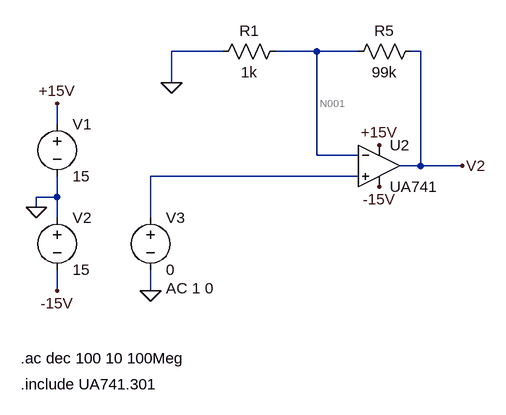
[diagram p0: schematic sim_ex2_g_10_non_invert.asc]
sim_ex2_g_10_non_invert.asc, the LTspice schematic file:
Version 4
SHEET 1 880 680
WIRE 0 -128 -80 -128
WIRE 144 -128 80 -128
WIRE 208 -128 144 -128
WIRE 304 -128 288 -128
WIRE -80 -80 -80 -128
WIRE -256 -16 -256 -48
WIRE 144 32 144 -128
WIRE 208 32 144 32
WIRE 304 48 304 -128
WIRE 304 48 272 48
WIRE 368 48 304 48
WIRE 208 64 -112 64
WIRE -256 96 -256 64
WIRE -256 96 -288 96
WIRE -288 112 -288 96
WIRE -256 128 -256 96
WIRE -112 128 -112 64
WIRE -256 240 -256 208
WIRE -112 240 -112 208
FLAG -288 112 0
FLAG -256 -48 +15V
FLAG -256 240 -15V
FLAG 240 16 +15V
FLAG 240 80 -15V
FLAG -112 240 0
FLAG 368 48 V2
FLAG -80 -80 0
SYMBOL voltage -256 -32 R0
WINDOW 123 0 0 Left 0
WINDOW 39 0 0 Left 0
SYMATTR InstName V1
SYMATTR Value 15
SYMBOL voltage -256 112 R0
WINDOW 123 0 0 Left 0
WINDOW 39 0 0 Left 0
SYMATTR InstName V2
SYMATTR Value 15
SYMBOL res 304 -144 R90
WINDOW 0 0 56 VBottom 2
WINDOW 3 32 56 VTop 2
SYMATTR InstName R5
SYMATTR Value 99k
SYMBOL voltage -112 112 R0
WINDOW 123 24 124 Left 2
WINDOW 39 0 0 Left 0
SYMATTR Value2 AC 1 0
SYMATTR InstName V3
SYMATTR Value 0
SYMBOL OpAmps\\opamp2 240 -16 R0
SYMATTR InstName U2
SYMATTR Value UA741
SYMBOL res 96 -144 R90
WINDOW 0 0 56 VBottom 2
WINDOW 3 32 56 VTop 2
SYMATTR InstName R1
SYMATTR Value 1k
TEXT -312 344 Left 2 !.ac dec 100 10 100Meg
TEXT -312 384 Left 2 !.include UA741.301

The netlist it stands for:
* sim_ex2_g_10_non_invert.asc
V1 +15V 0 15
V2 0 -15V 15
R5 V2 N001 99k
V3 N002 0 0 AC 1 0
XU2 N002 N001 +15V -15V V2 UA741  ; pins In+ In- V+ V- OUT
R1 N001 0 1k
.ac dec 100 10 100Meg
.include UA741.301
.backanno
.end

* Results of the author's LTspice run, read from the files saved beside the schematic
* Operating Point, zero values left out:
*   V(+15v) = 15 V
*   V(-15v) = -15 V
*   V(v2) = 9.01 mV
*   V(n001) = 11.14 µV
*   I(R1) = 11.14 nA
*   I(R5) = 90.9 nA
*   I(V3) = -79.74 nA
*   I(V2) = -1.667 mA
*   I(V1) = -1.667 mA
*   Ix(u2:1) = 79.74 nA
*   Ix(u2:2) = 79.76 nA
*   Ix(u2:3) = 1.667 mA
*   Ix(u2:4) = -1.667 mA
*   Ix(u2:5) = -90.9 nA
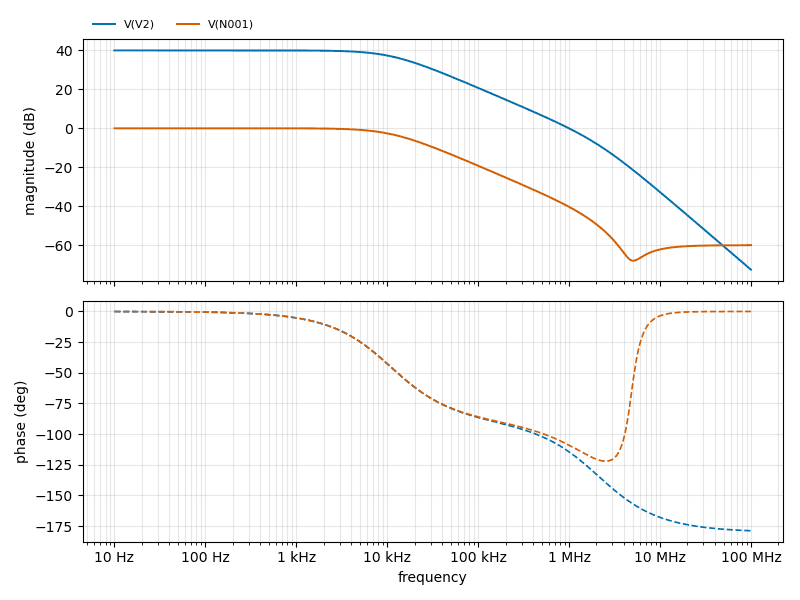
[diagram p1: AC Analysis of sim_ex2_g_10_non_invert.asc, plotted from the saved traces]
* AC Analysis, 1 run:
*   V(V2): 40.00 dB at 10 Hz, -72.68 dB at 100 MHz, peak 40.00 dB at 10 Hz, 3 dB below the peak at 10.97 kHz
*   V(N001): -0.00 dB at 10 Hz, -60.09 dB at 100 MHz, peak -0.00 dB at 10 Hz, 3 dB below the peak at 10.97 kHz